# EAGLE schematic pinheader_breakout (EAGLE 7.4.0)
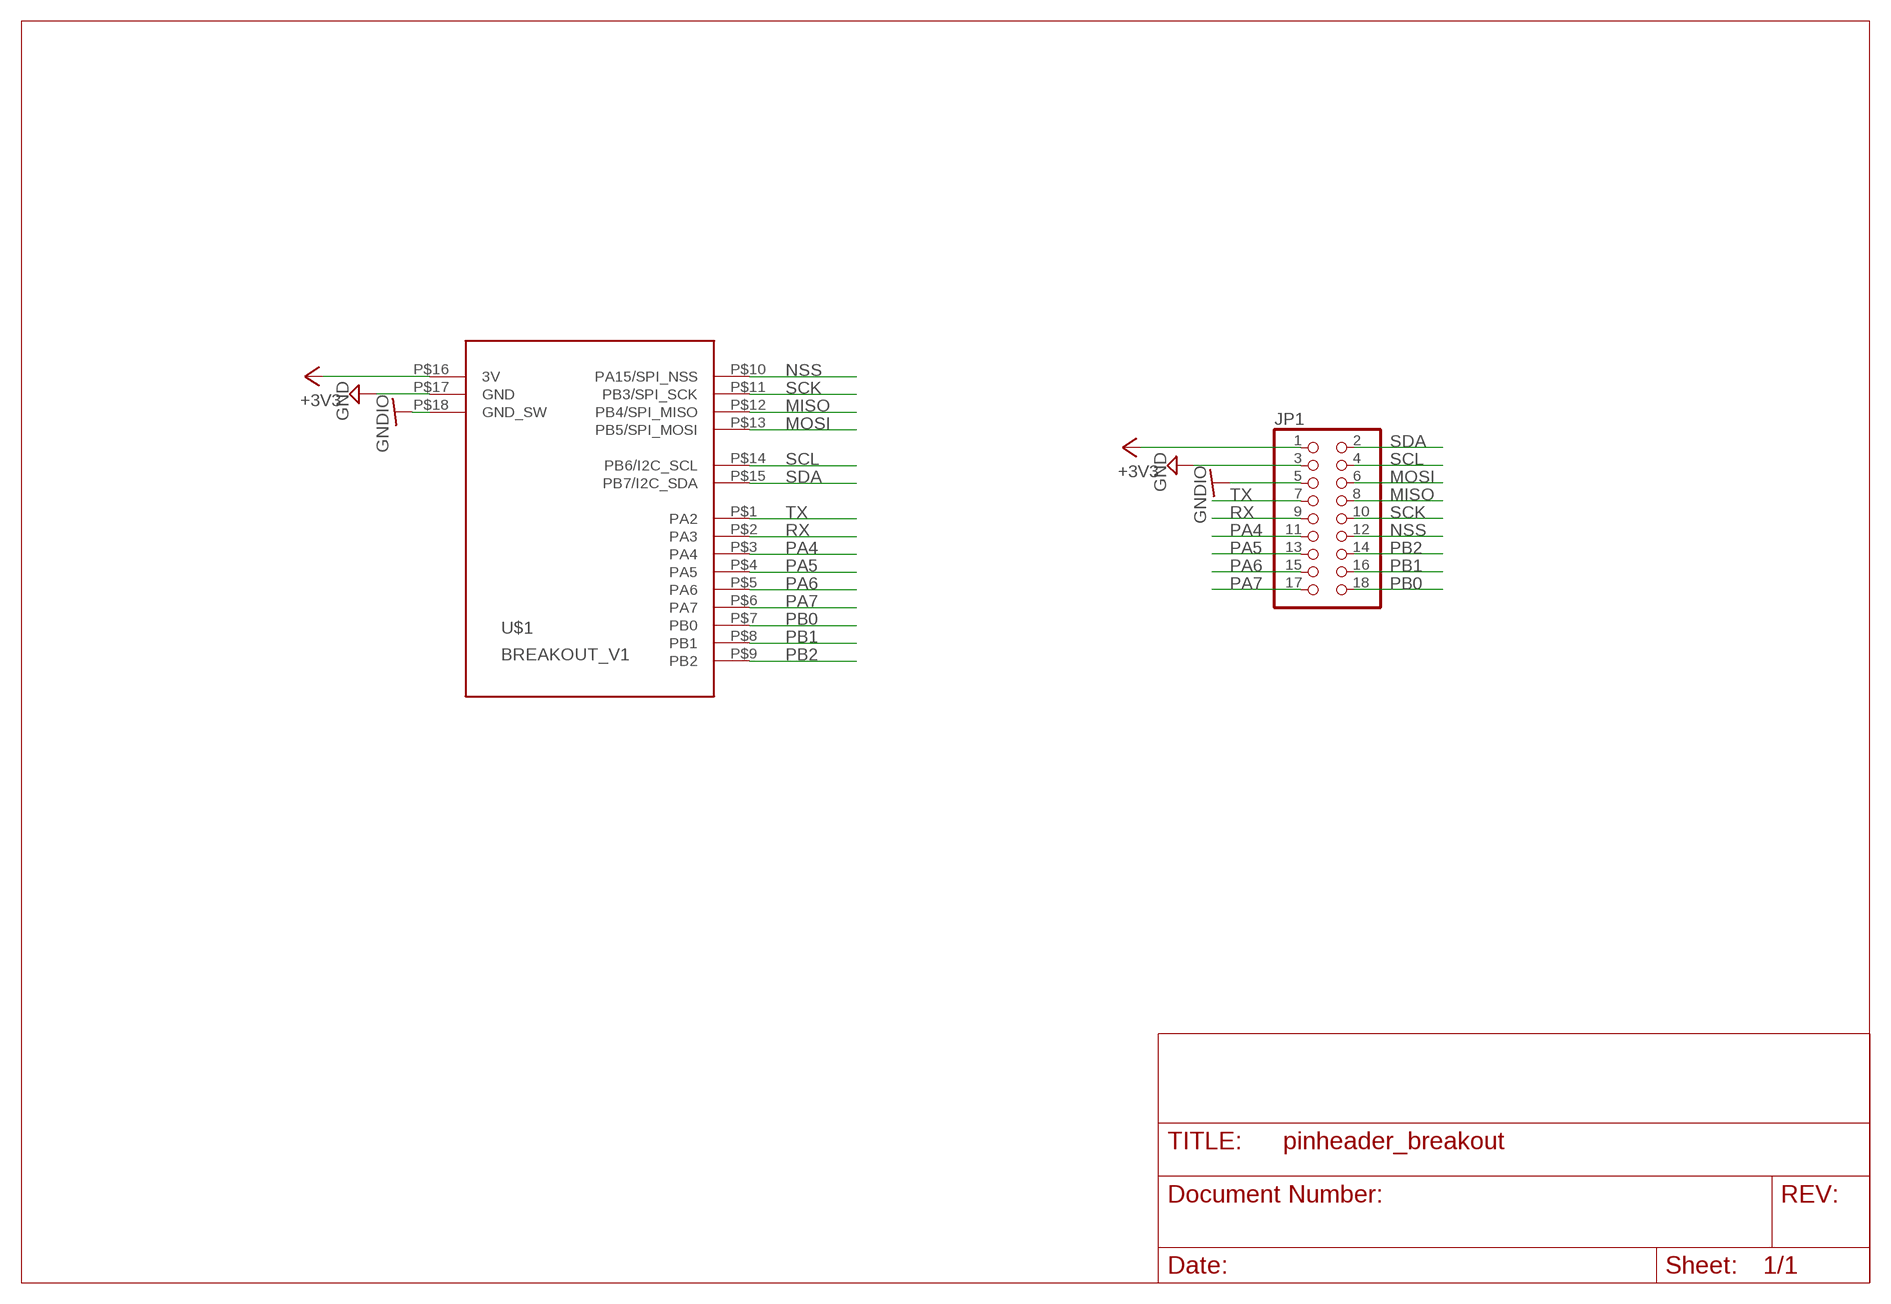
[diagram p0: schematic, sheet 1]

## Parts
JP1  PINHD-2X9_2.54-SMD  [2X09SMD]
U$1  BREAKOUT_V1  [BREAKOUT_V1]

## Nets
+3V3: JP1.1 U$1.P$16(3V)
GND: JP1.3 U$1.P$17(GND)
GNDIO: JP1.5 U$1.P$18(GND_SW)
MISO: JP1.8 U$1.P$12(PB4/SPI_MISO)
MOSI: JP1.6 U$1.P$13(PB5/SPI_MOSI)
NSS: JP1.12 U$1.P$10(PA15/SPI_NSS)
PA4: JP1.11 U$1.P$3(PA4)
PA5: JP1.13 U$1.P$4(PA5)
PA6: JP1.15 U$1.P$5(PA6)
PA7: JP1.17 U$1.P$6(PA7)
PB0: JP1.18 U$1.P$7(PB0)
PB1: JP1.16 U$1.P$8(PB1)
PB2: JP1.14 U$1.P$9(PB2)
RX: JP1.9 U$1.P$2(PA3)
SCK: JP1.10 U$1.P$11(PB3/SPI_SCK)
SCL: JP1.4 U$1.P$14(PB6/I2C_SCL)
SDA: JP1.2 U$1.P$15(PB7/I2C_SDA)
TX: JP1.7 U$1.P$1(PA2)

## Library data of the parts
JP1 = pinhead:PINHD-2X9: PIN HEADER
U$1 = breakout_base:BREAKOUT_V1